# EAGLE design LED_driver (EAGLE 8.3.2)
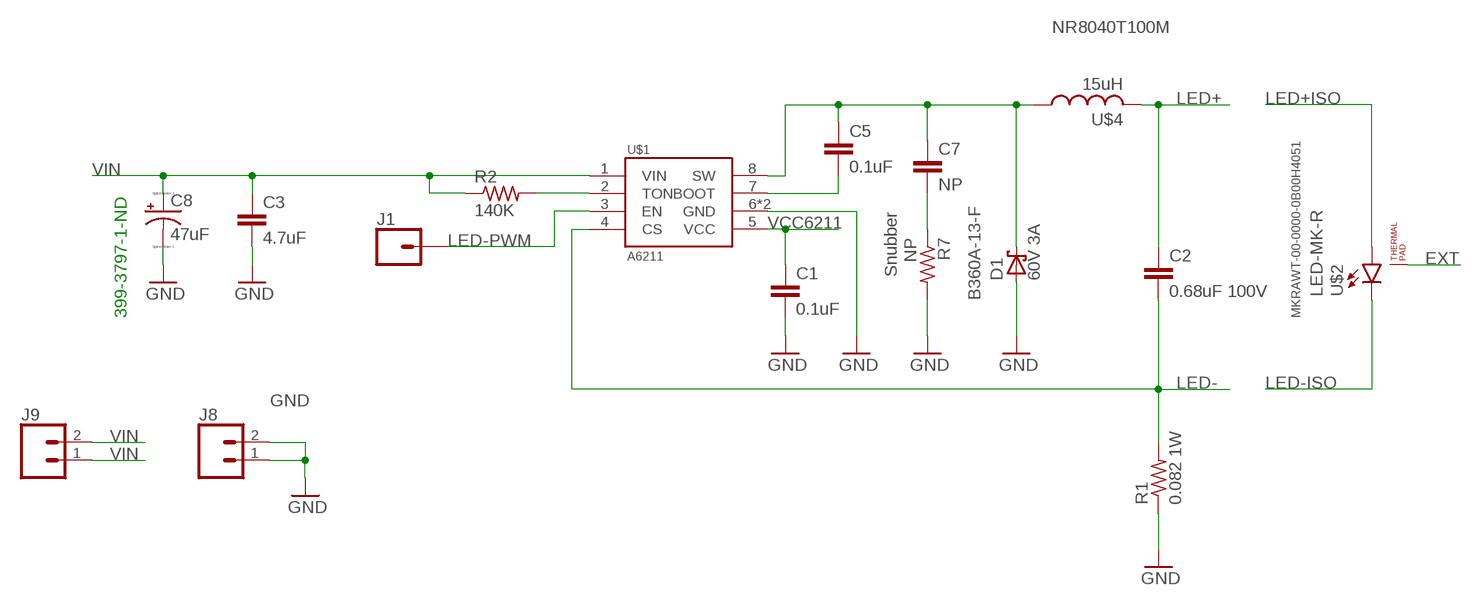
[diagram p0: schematic, sheet 1]

## Parts
C1  0.1uF  C-EUC0603  [C0603]
C2  0.68uF 100V  C-EUC0805  [C0805]
C3  4.7uF  C-EUC0603  [C0603]
C5  0.1uF  C-EUC0603  [C0603]
C7  NP  C-EUC0603  [C0603]
C8  47uF  C-TANTALUM(10UF_150UF)  [CTAN(7.30_4.30MM)]
D1  60V 3A  DIODE-SCHOTTKYSMA  [SMA]
J1  CONN_01  [1X01]
J8  CONN_021X02_NO_SILK  [1X02_NO_SILK]
J9  CONN_021X02_NO_SILK  [1X02_NO_SILK]
R1  0.082 1W  R-US_R2512  [R2512]
R2  140K  R-US_R0603  [R0603]
R7  NP  R-US_R1206  [R1206]
U$1  A6211  [SOIC8N-LJ]
U$2  LED-MK-R  [MK-R]
U$4  15uH  HCMA1305  [HCMA1305]

## Nets
EXT: U$2.EXP(THERMAL)
GND: C1.2 C3.2 C8.- D1.A J8.1 J8.2 R1.1 R7.2 U$1.6(GND) U$1.PAD(GND)
LED+: C2.1 U$4.P$2
LED+ISO: U$2.A
LED-: C2.2 R1.2 U$1.4(CS)
LED-ISO: U$2.C
LED-PWM: J1.1 U$1.3(EN)
N$1: R2.2 U$1.2(TON)
N$2: C7.2 R7.1
N$4: C5.2 U$1.7(BOOT)
N$5: C5.1 C7.1 D1.C U$1.8(SW) U$4.P$1
VCC6211: C1.1 U$1.5(VCC)
VIN: C3.1 C8.+ J9.1 J9.2 R2.1 U$1.1(VIN)

## Notes on the sheet
- NR8040T100M
- Snubber
- B360A-13-F
- 399-3797-1-ND | MKRAWT-00-0000-0B00H4051

## Library data of the parts
C1 C2 C5 C7 = resistor:C-EU: CAPACITOR, European symbol
C3 = rcl:C-EU: CAPACITOR, European symbol
C8 = PowerComponents:C-TANTALUM(10UF_150UF)
D1 = BlueRobotics-Main:DIODE-SCHOTTKY
J1 = SparkFun-Connectors:CONN_01: Single connection point. Often used as Generic Header-pin footprint for 0.1 inch spaced/style header connections On any of the 0.1 inch spaced packages, you can populate with these: Break Away Headers - Straight <https://www.sparkfun.com/products/116> (PRT-00116) Break Away Male Headers - Right Angle <https://www.sparkfun.com/products/553> (PRT-00553) Female Headers <https://www.sparkfun.com/products/115> (PRT-00115) Break Away Headers - Machine Pin <https://www.sparkfun.com/products/117> (PRT-00117) Break Away Female Headers - Swiss Machine Pin <https://www.sparkfun.com/products/743> (PRT-00743) This device is also useful as a general connection point to wire up your design to another part of your project. Our various solder wires solder well into these plated through hole pads. Hook-Up Wire - Assortment (Stranded, 22 AWG) <https://www.sparkfun.com/products/11375> (PRT-11375) Hook-Up Wire - Assortment (Solid Core, 22 AWG) <https://www.sparkfun.com/products/11367> (PRT-11367) View the entire wire category on our website here <https://www.sparkfun.com/categories/141> Special notes: SMTSO-256-ET is a "flush mount" nut for a 4-40 screw. We mostly use this on specialty testbeds; it is a nice way to connect hardware to your PCB at an adjustable hieght. Also note, the SNAP packages are for using a snappable style connector. We sell a baggie of snaps and they are also used on two LilyPad designs: Snap Assortment - 30 pack (male and female) <https://www.sparkfun.com/products/11347> (DEV-11347) LilyPad Arduino SimpleSnap <https://www.sparkfun.com/products/10941> (DEV-10941) LilyPad SimpleSnap Protoboard <https://www.sparkfun.com/products/10940> (DEV-10940)
J8 J9 = SparkFun-Connectors:CONN_02: Multi connection point. Often used as Generic Header-pin footprint for 0.1 inch spaced/style header connections On any of the 0.1 inch spaced packages, you can populate with these: Break Away Headers - Straight <https://www.sparkfun.com/products/116> (PRT-00116) Break Away Male Headers - Right Angle <https://www.sparkfun.com/products/553> (PRT-00553) Female Headers <https://www.sparkfun.com/products/115> (PRT-00115) Break Away Headers - Machine Pin <https://www.sparkfun.com/products/117> (PRT-00117) Break Away Female Headers - Swiss Machine Pin <https://www.sparkfun.com/products/743> (PRT-00743) For SCREWTERMINALS and SPRING TERMINALS visit here: Screw Terimnals on SparkFun.com <https://www.sparkfun.com/search/results?term=Screw+Terminals> (5mm/3.5mm/2.54mm spacing) This device is also useful as a general connection point to wire up your design to another part of your project. Our various solder wires solder well into these plated through hole pads. Hook-Up Wire - Assortment (Stranded, 22 AWG) <https://www.sparkfun.com/products/11375> (PRT-11375) Hook-Up Wire - Assortment (Solid Core, 22 AWG) <https://www.sparkfun.com/products/11367> (PRT-11367) View the entire wire category on our website here <https://www.sparkfun.com/categories/141> Special notes: Molex polarized connector foot print use with: PRT-08233 with associated crimp pins and housings. 2.54_SCREWTERM for use with PRT-10571. 3.5mm Screw Terminal footprints for PRT-08084 5mm Screw Terminal footprints for use with PRT-08432
R1 R2 R7 = resistor:R-US_: RESISTOR, American symbol
U$1 = BlueRobotics-Main:A6211
U$2 = BlueRobotics-Main:LED-MK-R
U$4 = DiscreteComponents:HCMA1305

## Board
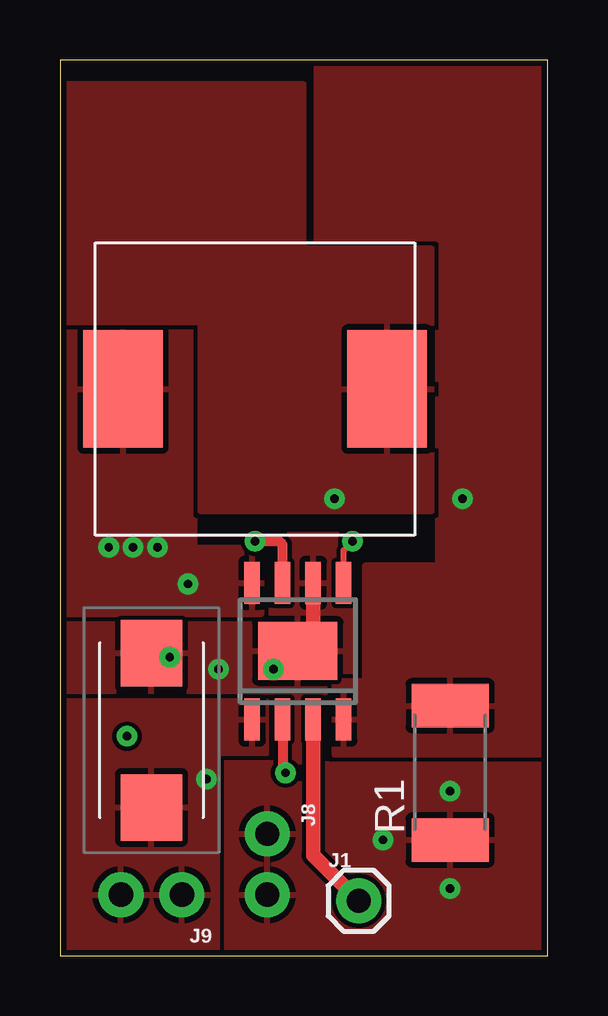
[diagram p1: board, top side]
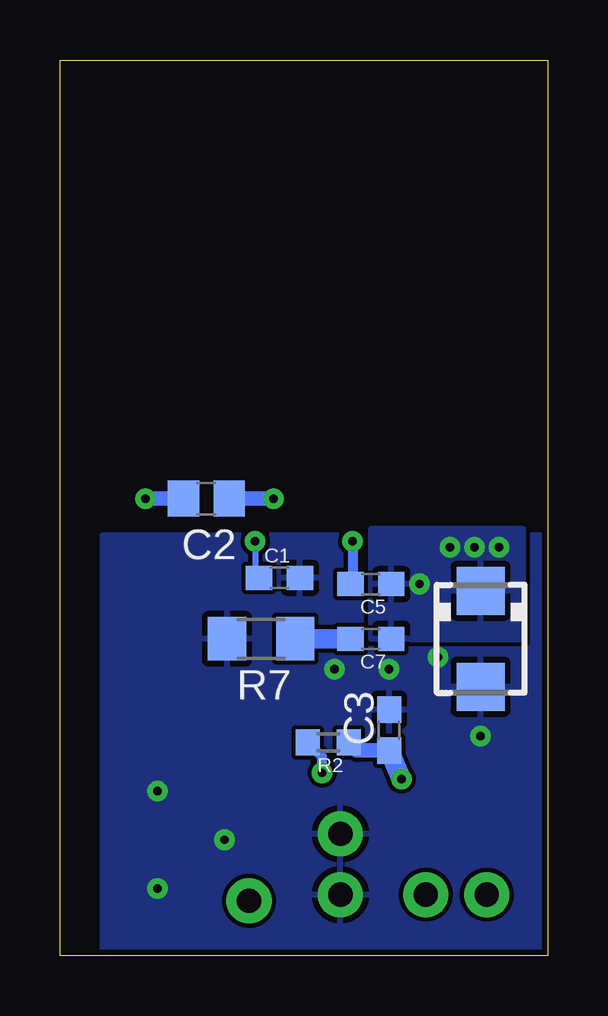
[diagram p2: board, bottom side, seen from below]

Size 20.32 x 37.34 mm. Coordinates in mm from the lower left corner, seen from the top.
Outline: 0,0 20.32,0 20.32,37.34 0,37.34 0,0
Copper layers (1*16): Top 0.035mm / dielectric 1.5mm / Bottom 0.035mm
Design rules "GoldPhoenix": minimum track width 7mil, minimum drill 10mil, track to track 7mil, track to pad 7mil, pad to pad 7mil, via to via 7mil, smd to smd 7mil, copper to edge 10mil, drill to drill 8mil, minimum pad ring 10mil, minimum via ring 10mil, stop-mask expansion 4mil, vias tented up to drill 25mil, thermal gap 10mil

### Footprints (pad centres in the part's own frame; a part is rotated, then mirrored left to right if it is on the bottom)
C0603 = smd 1.1 x 1: 1 -0.85,0; 2 0.85,0
C0805 = smd 1.3 x 1.5: 1 -0.95,0; 2 0.95,0
CTAN(7.30_4.30MM) = smd 2.77 x 2.55: + -3.22,0; - 3.22,0
SMA = smd 2 x 2: A 2,0; C -2,0
1X01 = drill 1.016 pad 1.88: 1 0,0
1X02_NO_SILK = drill 1.016 pad 1.88: 1 0,0; 2 2.54,0
R2512 = smd 1.8 x 3.2: 1 -2.8,0; 2 2.8,0
R0603 = smd 1 x 1.1: 1 -0.85,0; 2 0.85,0
R1206 = smd 1.6 x 1.803: 1 -1.422,0; 2 1.422,0
SOIC8N-LJ = smd 0.65 x 1.75: 1 -1.9,-2.86; 2 -0.63,-2.86; 3 0.64,-2.86; 4 1.91,-2.86; 5 1.91,2.84; 6 0.64,2.84; 7 -0.63,2.84; 8 -1.9,2.84 | smd 3.3 x 2.41: PAD 0,0
MK-R = smd 0.7 x 6.76: A 0,0; C 6.7,0 | smd 3.9 x 6.76: EXP 3.35,0
HCMA1305 = smd 4.9 x 3.3: P$1 0,5.5; P$2 0,-5.5

### Placement (x,y rotation side)
C1  11.18,15.75 0 bottom
C2  14.22,19.05 180 bottom
C3  6.6,9.4 90 bottom
C5  7.37,15.49 180 bottom
C7  7.37,13.21 180 bottom
C8  3.81,9.4 90 top
D1  2.79,13.21 270 bottom
J1  12.45,2.29 0 top
J8  8.64,5.08 270 top
J9  5.08,2.54 180 top
R1  16.26,7.62 90 top
R2  9.14,8.89 180 bottom
R7  11.94,13.21 180 bottom
U$1  9.91,12.7 0 top
U$2  24.13,44.96 0 top  (outside the outline)
U$4  8.13,23.62 90 top

### Tracks (layer width: path | path; a pad name or v marks a point on that pad's centre or on a via)
GND  (via drill 0.35)
  Top 0.61: C8.- 4.4,12.62 v4.57,12.45 | U$1.6 10.55,13.34 U$1.PAD
  other vias: 6.6,11.94 8.89,11.94 16.26,6.86 13.46,4.83 16.26,2.79 2.79,9.14
  pour Bottom (rank 6): 0,0 18.54,0 18.54,17.53 0,17.53
  pour Top (rank 6): 0,0.25 20.32,0.25 20.32,17.53 0,17.53
LED+  (via drill 0.35)
  Bottom 0.61: C2.1 v11.43,19.05
  pour Top: 5.84,18.54 15.49,18.54 15.49,29.46 10.16,29.46 10.16,36.32 0,36.32 0,26.42 5.84,26.42
LED-  (via drill 0.35)
  Bottom 0.61: C2.2 v16.76,19.05
  pour Top (rank 5): 11.43,8.38 20.32,8.38 20.32,37.34 10.67,37.34 10.67,29.72 15.75,29.72 15.75,16.26 12.7,16.26 12.7,11.43 11.43,11.43
LED-PWM
  Top 0.61: U$1.3 10.55,4.19 J1.1
N$1  (via drill 0.35)
  Top 0.406: U$1.2 9.28,7.74 v9.4,7.62
  Bottom 0.406: v9.4,7.62 9.4,8.29 R2.2
N$2
  Bottom 0.813: C7.2 R7.1
N$4  (via drill 0.35)
  Top 0.406: U$1.7 9.28,17.14 9.14,17.27 v8.13,17.27
  Bottom 0.406: v8.13,17.27 8.13,15.58 C5.2
N$5  (via drill 0.35)
  other vias: 2.03,17.02 3.05,17.02 4.06,17.02 5.33,15.49
  pour Top (rank 3): 0,26.92 5.59,26.92 5.59,17.02 8.38,17.02 8.38,14.22 0,14.22
  pour Bottom (rank 3): 1.02,17.78 7.37,17.78 7.37,13.21 1.02,13.21
VCC6211  (via drill 0.35)
  Top 0.254: U$1.5 11.82,16.9 v12.19,17.27
  Bottom 0.254: v12.19,17.27 12.19,15.91 C1.1
VIN  (via drill 0.35)
  Bottom 0.61: C3.1 7.95,8.55 R2.1
  Bottom 0.813: v6.1,7.37 C3.1
  pour Top: 0,0.25 6.6,0.25 6.6,8.38 8.64,8.38 8.64,10.67 0,10.67